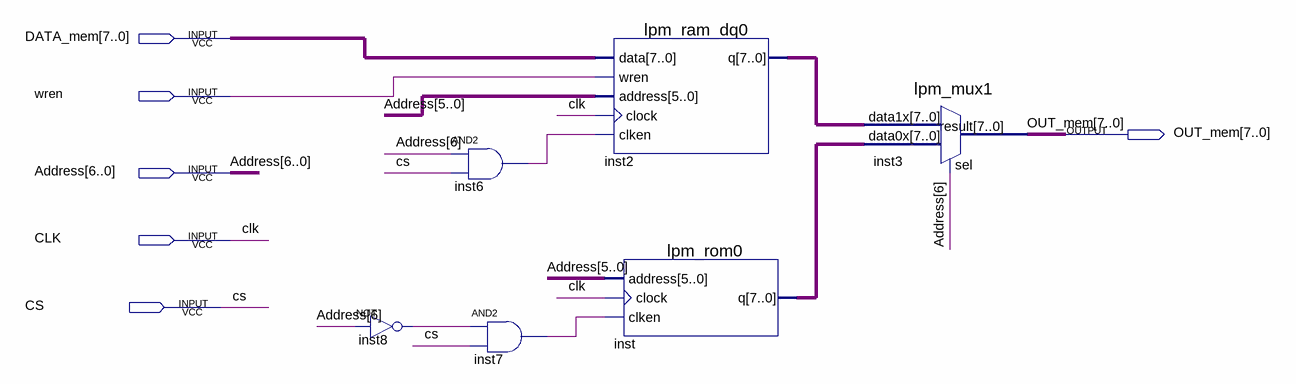
[diagram p0: schematic sheet]
// Quartus schematic test_mem.bdf as structural Verilog: 6 symbols, 6 pins
module test_mem (
  input  [7:0] DATA_mem,
  input  wren,
  input  [6:0] Address,
  input  CLK,
  input  CS,
  output [7:0] OUT_mem
);

  wire inst6_out, inst7_out, inst8_out;
  wire [7:0] inst2_q, inst_q;

  not inst8 (inst8_out, Address[6]);
  and inst6 (inst6_out, Address[6], CS);
  and inst7 (inst7_out, inst8_out, CS);
  lpm_ram_dq0 inst2 (.data(DATA_mem), .wren(wren), .address(Address[5:0]), .clock(CLK), .clken(inst6_out), .q(inst2_q));
  lpm_rom0 inst (.address(Address[5:0]), .clock(CLK), .clken(inst7_out), .q(inst_q));
  lpm_mux1 inst3 (.data1x(inst2_q), .data0x(inst_q), .sel(Address[6]), .result(OUT_mem));
endmodule
